# EAGLE design MotionSense (EAGLE 9.6.2)
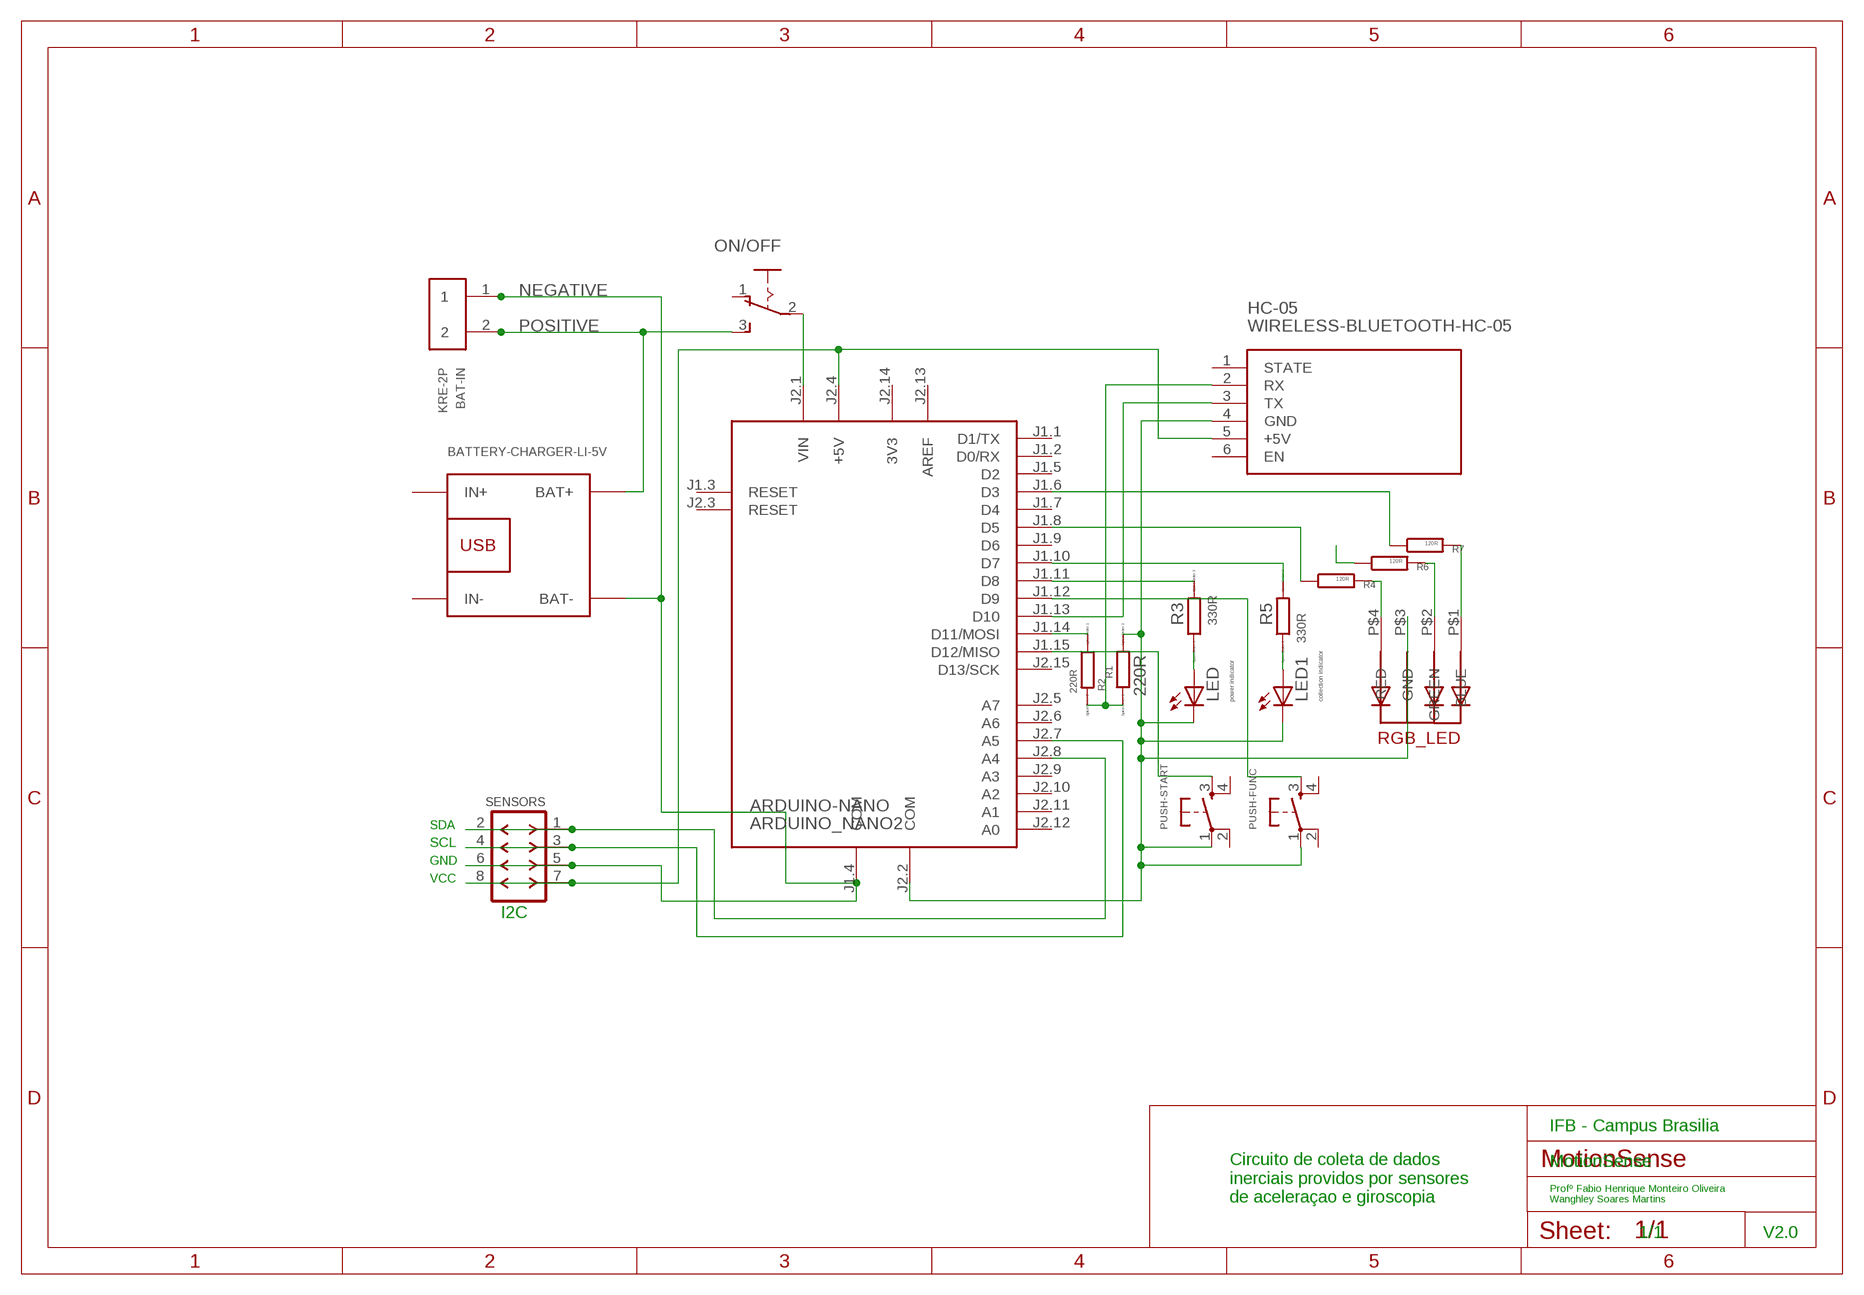
[diagram p0: schematic, sheet 1]

## Parts
ARDUINO-NANO  ARDUINO_NANO2  [ARDUINO_NANO2]
BAT-IN  KRE-2P  [KRE-2P]
HC-05  WIRELESS-BLUETOOTH-HC-05  [WIRELESS-BLUETOOTH-HC-05]
LED  power indicator  LED5MM  [LED5MM]
LED1  collection indicator  LED5MM  [LED5MM]
ON/OFF  255SB  [255SB]
PUSH-FUNC  DTS-6  [DTS-6]
PUSH-START  DTS-6  [DTS-6]
R1  220R  R0207/10  [0207/10]
R2  220R  R0207/10  [0207/10]
R3  330R  R0207/10  [0207/10]
R4  120R  R-EU_0204/7  [0204/7]
R5  330R  R0207/10  [0207/10]
R6  120R  R-EU_0204/7  [0204/7]
R7  120R  R-EU_0204/7  [0204/7]
RGB_LED  5MMRGBLED  [LED5MMRGB]
SENSORS  F-2X04-DIL-2MM_M  [DIL-2MM-2X04_M]
U$1  BATTERY-CHARGER-LI-5V  [BATTERY-CHARGER-LI-5V]

## Nets
N$1: LED.A R3.1
N$2: ARDUINO-NANO.J2.4(+5V) HC-05.5(+5V) SENSORS.7 SENSORS.8
N$3: ARDUINO-NANO.J1.14(D11/MOSI) R2.1
N$4: ARDUINO-NANO.J2.2(COM) HC-05.4(GND) LED1.K(C) LED.K(C) PUSH-FUNC.1 PUSH-START.1 R1.2 RGB_LED.P$3(GND)
N$5: ARDUINO-NANO.J1.13(D10) HC-05.3(TX)
N$6: HC-05.2(RX) R1.1 R2.2
N$7: ARDUINO-NANO.J2.7(A5) SENSORS.3 SENSORS.4
N$8: ARDUINO-NANO.J2.8(A4) SENSORS.1 SENSORS.2
N$9: ARDUINO-NANO.J1.10(D7) R5.2
N$10: ARDUINO-NANO.J1.15(D12/MISO) PUSH-START.3
N$11: ARDUINO-NANO.J2.1(VIN) ON/OFF.2(P)
N$12: ARDUINO-NANO.J1.12(D9) PUSH-FUNC.3
N$13: ARDUINO-NANO.J1.11(D8) R3.2
N$14: LED1.A R5.1
N$17: R4.2 RGB_LED.P$4(RED)
N$18: R6.2 RGB_LED.P$2(GREEN)
N$19: R7.2 RGB_LED.P$1(BLUE)
N$20: ARDUINO-NANO.J1.8(D5) R4.1
N$21: R6.1
N$22: ARDUINO-NANO.J1.6(D3) R7.1
NEGATIVE: ARDUINO-NANO.J1.4(COM) BAT-IN.1 SENSORS.5 SENSORS.6 U$1.BAT-
POSITIVE: BAT-IN.2 ON/OFF.3(S) U$1.BAT+
Unconnected: ARDUINO-NANO.J1.1(D1/TX) ARDUINO-NANO.J1.2(D0/RX) ARDUINO-NANO.J1.3(RESET) ARDUINO-NANO.J1.5(D2) ARDUINO-NANO.J1.7(D4) ARDUINO-NANO.J1.9(D6) ARDUINO-NANO.J2.3(RESET) ARDUINO-NANO.J2.5(A7) ARDUINO-NANO.J2.6(A6) ARDUINO-NANO.J2.9(A3) ARDUINO-NANO.J2.10(A2) ARDUINO-NANO.J2.11(A1) ARDUINO-NANO.J2.12(A0) ARDUINO-NANO.J2.15(D13/SCK) HC-05.1(STATE) HC-05.6(EN) ON/OFF.1(O) PUSH-FUNC.2 PUSH-FUNC.4 PUSH-START.2 PUSH-START.4 U$1.IN+ U$1.IN-

## Notes on the sheet
- SDA
- SCL
- GND
- VCC
- I2C
- IFB - Campus Brasilia
- MotionSense
- Circuito de coleta de dados 
  inerciais providos por sensores 
  de aceleraçao e giroscopia
- Profº Fabio Henrique Monteiro Oliveira
  Wanghley Soares Martins
- 1/1 | V2.0

## Power pins joined to a net without a drawn wire
3V3: ARDUINO-NANO.J2.14(3V3)
AREF: ARDUINO-NANO.J2.13(AREF)

## Library data of the parts
ARDUINO-NANO = arduino_2012:ARDUINO_NANO2: Arduino Nano2 Auto generated by modulcreator.ulp \;; ANZAHL: 2; MODUL: TRUE; STECKX0: -76200; STECKX1: 76200; STECKY0: 177800; STECKY1: 177800
BAT-IN = kre:KRE-2P: KRE Conector 2P
HC-05 = diy-modules:WIRELESS-BLUETOOTH-HC-05: Bluetooth Transceiver Module based on HC-05 board Tutorial is available here: https://arduino-info.wikispaces.com/BlueTooth-HC05-HC06-Modules-How-To Click here to find device on ebay.com <http://www.ebay.com/sch/hc-05+module+rs232>
LED LED1 = led:LED: LED OSRAM: - CHIPLED LG R971, LG N971, LY N971, LG Q971, LY Q971, LO R971, LY R971 LH N974, LH R974 LS Q976, LO Q976, LY Q976 LO Q996 - Hyper CHIPLED LW Q18S LB Q993, LB Q99A, LB R99A - SideLED LS A670, LO A670, LY A670, LG A670, LP A670 LB A673, LV A673, LT A673, LW A673 LH A674 LY A675 LS A676, LA A676, LO A676, LY A676, LW A676 LS A679, LY A679, LG A679 - Hyper Micro SIDELED® LS Y876, LA Y876, LO Y876, LY Y876 LT Y87S - SmartLED LW L88C, LW L88S LB L89C, LB L89S, LG L890 LS L89K, LO L89K, LY L89K LS L896, LA L896, LO L896, LY L896 - TOPLED LS T670, LO T670, LY T670, LG T670, LP T670 LSG T670, LSP T670, LSY T670, LOP T670, LYG T670 LG T671, LOG T671, LSG T671 LB T673, LV T673, LT T673, LW T673 LH T674 LS T676, LA T676, LO T676, LY T676, LB T676, LH T676, LSB T676, LW T676 LB T67C, LV T67C, LT T67C, LS T67K, LO T67K, LY T67K, LW E67C LS E67B, LA E67B, LO E67B, LY E67B, LB E67C, LV E67C, LT E67C LW T67C LS T679, LY T679, LG T679 LS T770, LO T770, LY T770, LG T770, LP T770 LB T773, LV T773, LT T773, LW T773 LH T774 LS E675, LA E675, LY E675, LS T675 LS T776, LA T776, LO T776, LY T776, LB T776 LHGB T686 LT T68C, LB T68C - Hyper Mini TOPLED® LB M676 - Mini TOPLED Santana® LG M470 LS M47K, LO M47K, LY M47K Source: http://www.osram.convergy.de LUXEON: - LUMILED® LXK2-PW12-R00, LXK2-PW12-S00, LXK2-PW14-U00, LXK2-PW14-V00 LXK2-PM12-R00, LXK2-PM12-S00, LXK2-PM14-U00 LXK2-PE12-Q00, LXK2-PE12-R00, LXK2-PE12-S00, LXK2-PE14-T00, LXK2-PE14-U00 LXK2-PB12-K00, LXK2-PB12-L00, LXK2-PB12-M00, LXK2-PB14-N00, LXK2-PB14-P00, LXK2-PB14-Q00 LXK2-PR12-L00, LXK2-PR12-M00, LXK2-PR14-Q00, LXK2-PR14-R00 LXK2-PD12-Q00, LXK2-PD12-R00, LXK2-PD12-S00 LXK2-PH12-R00, LXK2-PH12-S00 LXK2-PL12-P00, LXK2-PL12-Q00, LXK2-PL12-R00 Source: www.luxeon.com KINGBRIGHT: KA-3528ASYC Source: www.kingbright.com
ON/OFF = switch:255SB: SLIDING SWITCH Distributor Buerklin, 11G810
PUSH-FUNC PUSH-START = switch-tact:DTS-6
R1-R3 R5 = eagle-ltspice:R: RESISTOR, European symbol; SPICEMODEL: NONE; SPICEPREFIX: R
R4 R6 R7 = rcl:R-EU_: RESISTOR, European symbol; SPICEPREFIX: R
RGB_LED = led_rgb:5MMRGBLED
SENSORS = con-headers-jp:F-2X04-: FEMALE HEADER
U$1 = diy-modules:BATTERY-CHARGER-LI-5V: Lithium Battery 5V Charger More details available here: http://www.buildcircuit.com/how-to-use-micro-usb-5v-1a-lithium-battery-charging-board-charger-module/ Click here to find device on ebay.com <http://www.ebay.com/sch/tp4056+charger+usb>

## Board
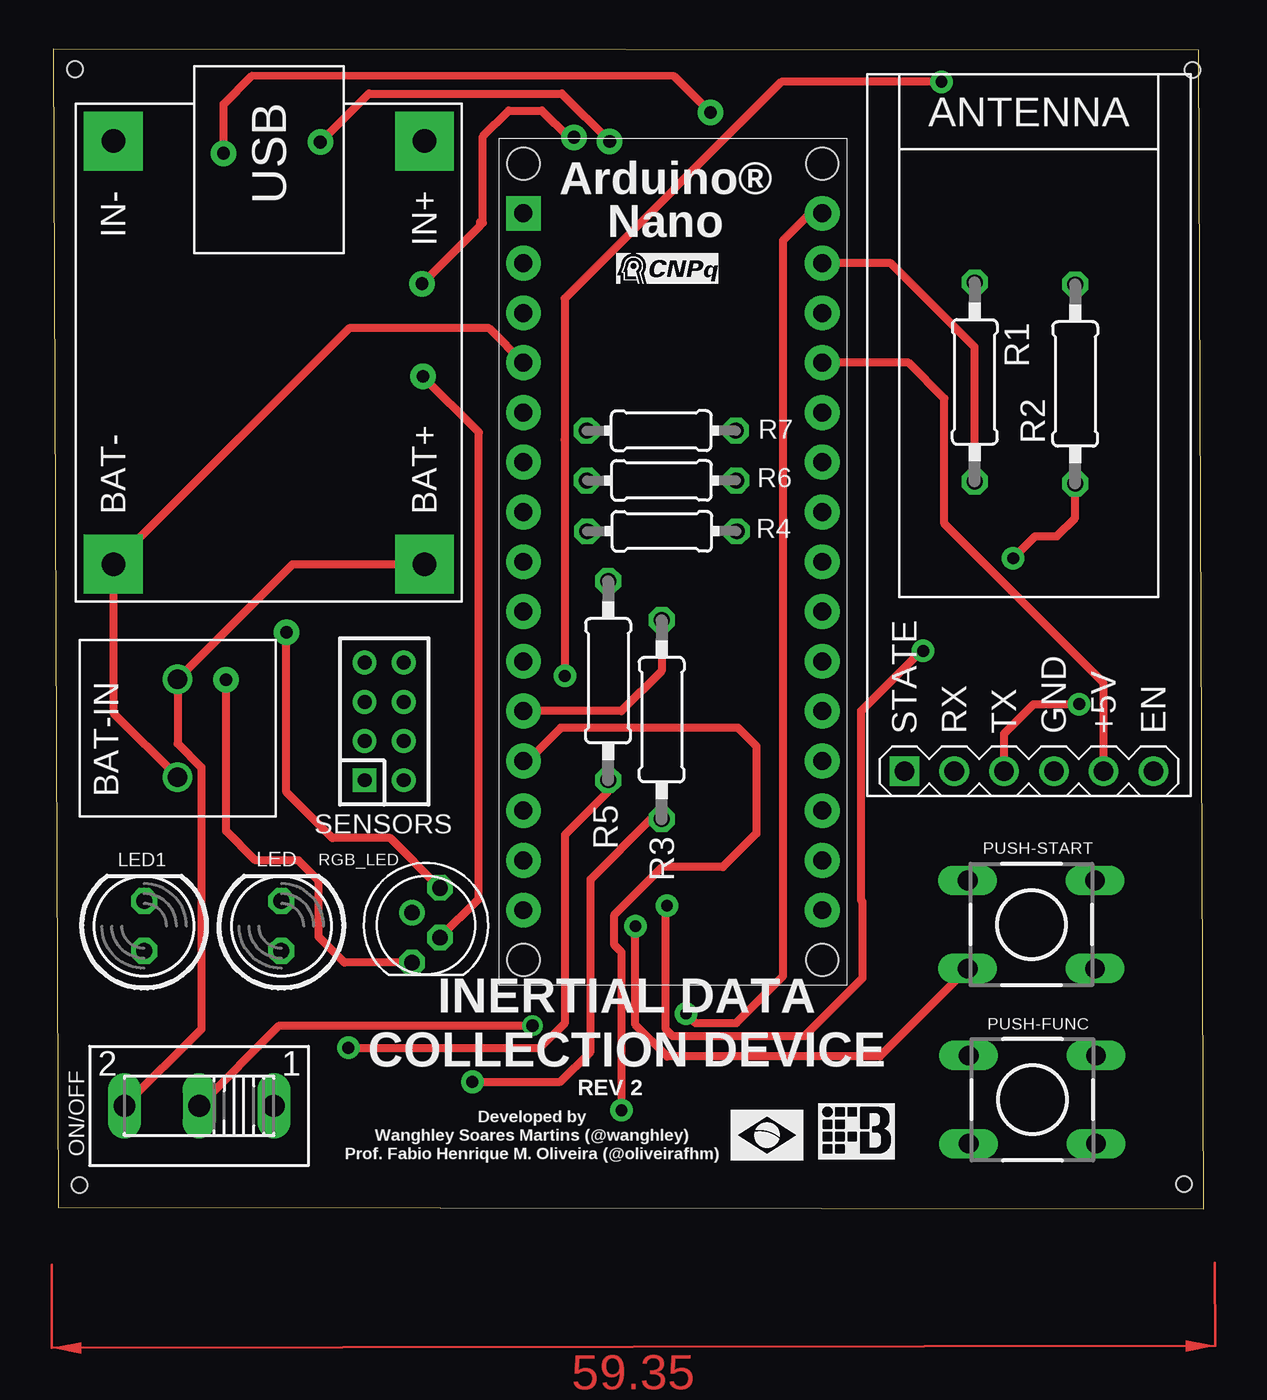
[diagram p1: board, top side]
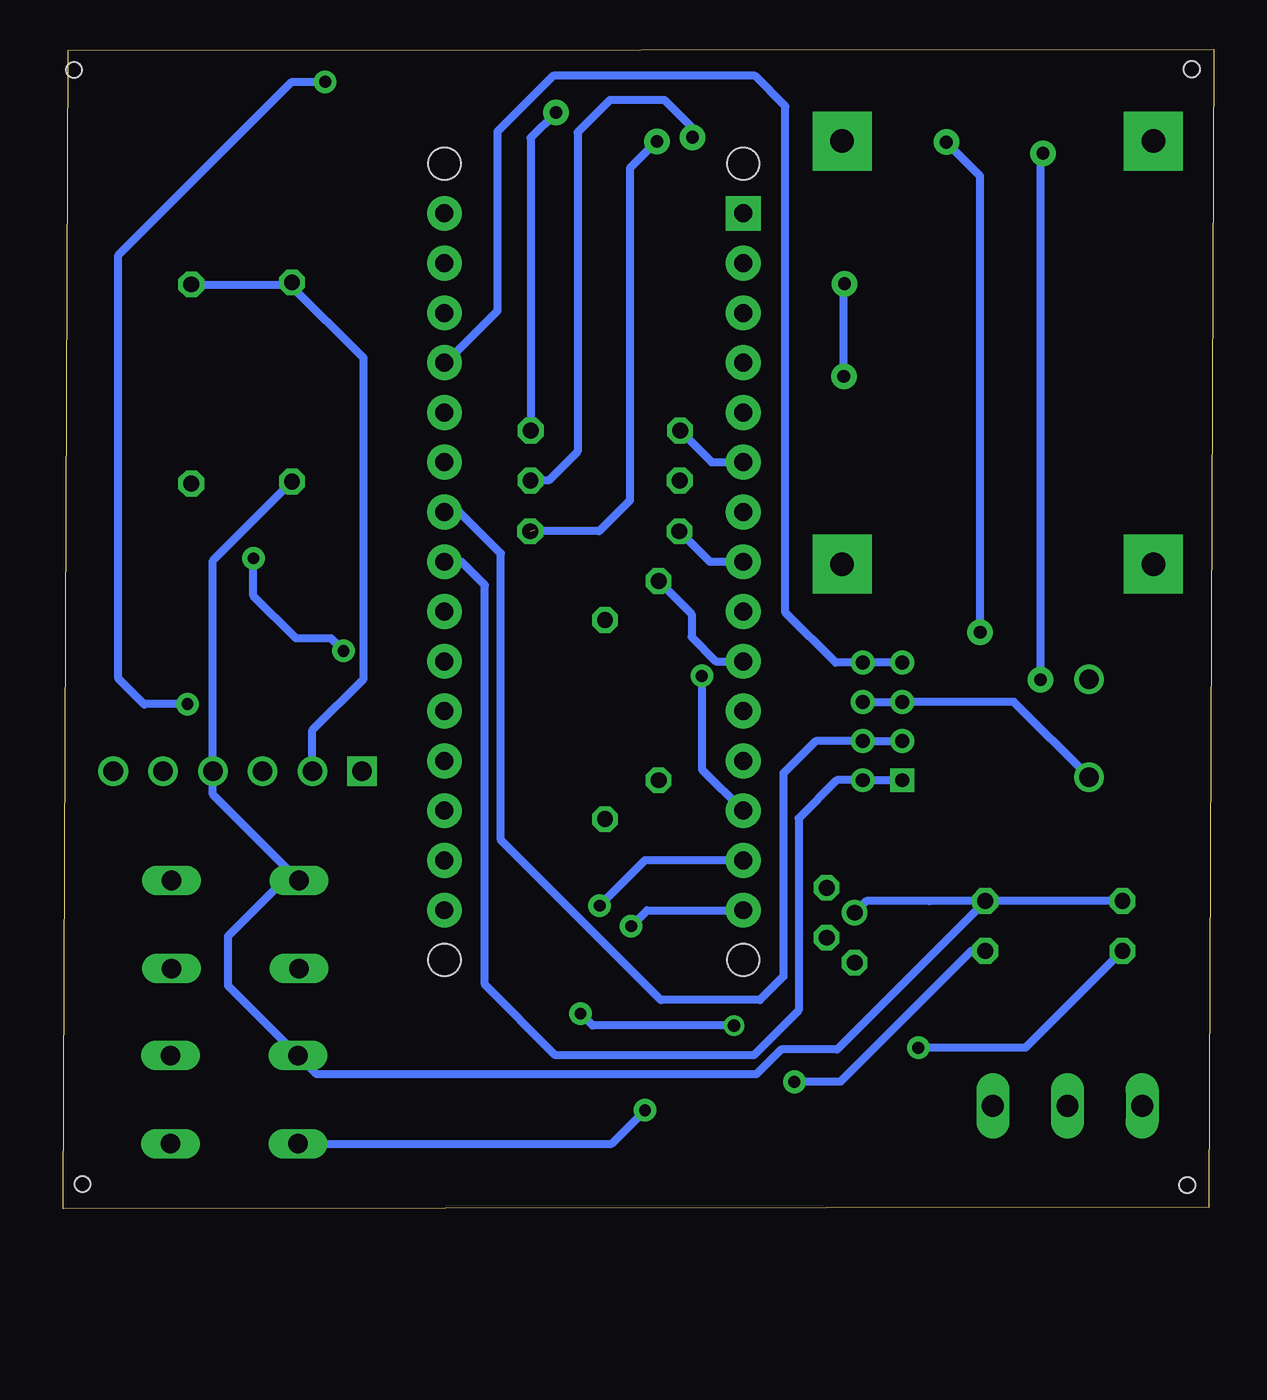
[diagram p2: board, bottom side, seen from below]

Size 58.69 x 59.18 mm. Coordinates in mm from the lower left corner, seen from the top.
Outline: 0.25,0.08 58.69,0 58.44,59.11 0,59.18 0.25,0.08
Copper layers (1*16): Top 0.035mm / dielectric 1.5mm / Bottom 0.035mm
Design rules "default *": minimum track width 6mil, minimum drill 0.35mm, track to track 10mil, track to pad 10mil, pad to pad 10mil, via to via 10mil, smd to smd 10mil, copper to edge 40mil, drill to drill 6mil, minimum pad ring 10mil, minimum via ring 8mil, stop-mask expansion 4mil, vias tented up to drill 0mil, thermal gap 10mil
Holes 0.8 mm at 57.7,1.26 58.13,58.12 1.11,58.15 1.35,1.21

### Footprints (pad centres in the part's own frame; a part is rotated, then mirrored left to right if it is on the bottom)
ARDUINO_NANO2 = drill 0.914 pad 1.778 square: J1.1 -7.62,17.78 | drill 0.914 pad 1.778: J1.2 -7.62,15.24; J1.3 -7.62,12.7; J1.4 -7.62,10.16; J1.5 -7.62,7.62; J1.6 -7.62,5.08; J1.7 -7.62,2.54; J1.8 -7.62,0; J1.9 -7.62,-2.54; J1.10 -7.62,-5.08; J1.11 -7.62,-7.62; J1.12 -7.62,-10.16; J1.13 -7.62,-12.7; J1.14 -7.62,-15.24; J1.15 -7.62,-17.78; J2.1 7.62,17.78; J2.2 7.62,15.24; J2.3 7.62,12.7; J2.4 7.62,10.16; J2.5 7.62,7.62; J2.6 7.62,5.08; J2.7 7.62,2.54; J2.8 7.62,0; J2.9 7.62,-2.54; J2.10 7.62,-5.08; J2.11 7.62,-7.62; J2.12 7.62,-10.16; J2.13 7.62,-12.7; J2.14 7.62,-15.24; J2.15 7.62,-17.78 | hole 1.651: -7.62,-20.32; 7.62,-20.32; 7.62,20.32; -7.62,20.32
KRE-2P = drill 1: 1 -2.54,0; 2 2.46,0
WIRELESS-BLUETOOTH-HC-05 = drill 1 square: 1 -6.35,-17.145 | drill 1: 2 -3.81,-17.145; 3 -1.27,-17.145; 4 1.27,-17.145; 5 3.81,-17.145; 6 6.35,-17.145
LED5MM = drill 0.813 octagon: A -1.27,0; K 1.27,0
255SB = drill 1.118 long: 1 -3.81,0; 2 0,0; 3 3.81,0
DTS-6 = drill 1 long: 1 -3.25,2.25; 2 3.25,2.25; 3 -3.25,-2.25; 4 3.25,-2.25
0207/10 = drill 0.813 octagon: 1 -5.08,0; 2 5.08,0
0204/7 = drill 0.813 octagon: 1 -3.81,0; 2 3.81,0
LED5MMRGB = drill 0.8 pad 0.813 octagon: P$1 -1.905,0.714; P$2 -0.635,-0.714; P$4 1.905,-0.714 | drill 0.8 pad 0.813: P$3 0.635,0.714
DIL-2MM-2X04_M = drill 0.711 square: 1 -3,1 | drill 0.711: 2 -3,-1; 3 -1,1; 4 -1,-1; 5 1,1; 6 1,-1; 7 3,1; 8 3,-1
BATTERY-CHARGER-LI-5V = drill 1.2 pad 3 square: BAT+ 10.795,8.255; BAT- 10.795,-7.62; IN+ -10.795,8.255; IN- -10.795,-7.62

### Placement (x,y rotation side)
ARDUINO-NANO  31.62,33.01 0 top
BAT-IN  6.35,24.56 90 top
HC-05  49.78,39.47 0 top
LED  11.65,14.43 90 top
LED1  4.65,14.43 90 top
ON/OFF  7.45,5.25 180 top
PUSH-FUNC  49.96,5.56 0 top
PUSH-START  49.91,14.5 0 top
R1  47.02,42.19 270 top
R2  52.15,42.09 90 top
R3  31.05,24.96 90 top
R4  31.06,34.57 0 top
R5  28.32,26.94 90 top
R6  31.04,37.17 0 top
R7  31.03,39.71 0 top
RGB_LED  19.02,14.47 90 top
SENSORS  16.89,24.87 90 top
U$1  10.69,43.69 270 top

### Tracks (layer width: path | path; a pad name or v marks a point on that pad's centre or on a via)
N$1  (via drill 0.6 pad 1.15)
  Top 0.406: v21.39,6.47 25.88,6.47 27.42,8.01 27.42,16.8 30.49,19.88 R3.1
  Bottom 0.406: LED.A 12.36,13.16 19.04,6.47 v21.39,6.47
N$2
  Top 0.406: HC-05.5 53.59,26.82 45.47,34.95 45.47,41.35 43.64,43.17 ARDUINO-NANO.J2.4
  Bottom 0.406: 21.84,56.26 21.84,30.42 19.29,27.87 SENSORS.8 SENSORS.7 | 21.86,55.24 21.86,56.26 21.84,56.26 | 21.84,56.26 23.39,57.81 33.7,57.81 36.54,54.97 36.54,45.81 39.18,43.17 ARDUINO-NANO.J2.4
N$3  (via drill 0.6 pad 1.15)
  Top 0.406: 52.15,36.84 R2.1 52.15,35.25 51.21,34.32 50.1,34.32 v48.98,33.19 | v31.32,15.46 31.26,15.41 31.26,9.14 31.6,8.8 38.33,8.8 41.29,11.76 41.29,15.67 41.22,15.73 41.22,25.4 44.29,28.46 v44.39,28.46
  Bottom 0.406: 44.45,28.56 44.45,28.52 v44.39,28.46 45.02,29.1 46.81,29.1 48.98,31.27 v48.98,33.19 | ARDUINO-NANO.J1.14 29.01,17.77 v31.32,15.46
N$4  (via drill 0.35 pad 1.2)
  Top 0.406: R1.2 47.02,43.98 42.74,48.25 ARDUINO-NANO.J2.2
  Bottom 0.406: LED1.K LED.K | LED.K 14.49,15.7 | R1.2 51.05,33.07 HC-05.4 51.05,21.15 PUSH-START.1 47.43,16.75 50.28,13.91 50.28,11.38 PUSH-FUNC.1 45.76,6.86 23.33,6.86 22.07,8.12 19.2,8.12 11.65,15.67 LED.K | LED.K 17.72,15.7 RGB_LED.P$3
  other vias: 46.71,7.81
N$5  (via drill 0.6 pad 1.15)
  Top 0.406: HC-05.3 48.51,24.24 50.02,25.75 v52.35,25.75 | 26.05,27.25 v26.11,27.19 26.11,39.24 26.1,39.24 26.1,46.45 37.15,57.51 v45.32,57.51
  Bottom 0.406: v26.11,27.19 26.11,22.42 ARDUINO-NANO.J1.13 | v52.35,25.75 54.52,25.75 54.55,25.72 55.87,27.05 55.87,48.66 47.03,57.51 v45.32,57.51
N$6
  Bottom 0.381: 47.09,47.19 R1.1
  Bottom 0.406: R2.2 47.12,47.17 | 47.12,47.17 R1.1 | HC-05.2 45.97,24.42 43.36,27.04 43.36,43.41 47.12,47.17
N$7
  Bottom 0.406: SENSORS.3 SENSORS.4 20.3,23.87 21.95,22.22 21.95,11.85 23.15,10.65 28.2,10.65 36.36,18.81 36.36,33.44 38.48,35.55 ARDUINO-NANO.J2.7
N$8
  Bottom 0.406: SENSORS.1 SENSORS.2 19.22,21.87 21.17,19.92 21.17,10.12 23.45,7.83 33.57,7.83 37.18,11.44 37.18,31.82 38.37,33.01 ARDUINO-NANO.J2.8
N$9
  Bottom 0.406: R5.2 26.63,30.34 26.63,29.18 25.39,27.93 ARDUINO-NANO.J1.10
N$10  (via drill 0.6 pad 1.15)
  Top 0.406: PUSH-START.3 42.18,7.77 31.32,7.77 29.71,9.38 v29.71,14.42
  Bottom 0.406: v29.71,14.42 28.9,15.23 ARDUINO-NANO.J1.15
N$11  (via drill 0.6 pad 1.15, 0.65)
  Top 0.406: v32.29,9.95 32.77,9.48 34.85,9.48 37.25,11.87 37.25,49.42 38.62,50.79 ARDUINO-NANO.J2.1 | 7.45,5.93 ON/OFF.2 11.55,9.34 v24.46,9.34
  Bottom 0.406: 32.29,9.61 v32.29,9.95 31.68,9.34 v24.46,9.34
N$12  (via drill 0.6 pad 1.15)
  Top 0.406: ARDUINO-NANO.J1.12 24.21,22.85 25.89,24.53 34.95,24.53 35.87,23.61 35.87,19.14 34.17,17.43 31.07,17.43 28.63,14.99 28.63,13.45 29,13.08 v29,5.02
  Bottom 0.406: PUSH-FUNC.3 30.71,3.31 v29,5.02
N$13
  Top 0.406: R3.2 31.05,27.45 28.99,25.39 ARDUINO-NANO.J1.11
N$14  (via drill 0.6 pad 1.15)
  Top 0.406: v15.06,8.21 24.84,8.21 26.12,9.49 26.12,19.1 28.32,21.29 R5.1
  Bottom 0.406: LED1.A 9.6,8.21 v15.06,8.21
N$16  (via drill 0.35 pad 1.3)
  other vias: 6.36,27
N$17  (via drill 0.65 pad 1.3)  (1 unrouted)
  Top 0.406: RGB_LED.P$4 17.2,18.91 14.25,18.91 11.91,21.25 v11.91,29.42 | v13.63,54.43 16.11,56.91 25.96,56.91 v28.4,54.47
  Bottom 0.406: v11.91,29.42 11.91,52.7 v13.63,54.43 | 34.63,34.65 | v28.4,54.47 29.77,53.09 29.77,36.14 31.35,34.57 R4.2
N$18  (via drill 0.65 pad 1.3)
  Top 0.406: RGB_LED.P$2 21.72,15.81 21.72,39.62 v18.87,42.47 | v18.83,47.2 21.77,50.15 | 21.77,50.36 21.77,50.15 | 21.77,50.15 21.93,50.31 21.93,54.73 23.24,56.04 24.94,56.04 26.3,54.68 v26.58,54.68
  Bottom 0.406: v18.87,42.47 18.87,46.83 18.95,46.91 18.95,47.08 v18.83,47.2 | v26.58,54.68 26.58,55.14 28.01,56.57 30.8,56.57 32.45,54.92 32.45,38.64 33.92,37.16 R6.2
N$19  (via drill 0.65 pad 1.3)
  Top 0.406: RGB_LED.P$1 14.86,12.56 13.55,13.87 13.55,16.73 12.51,17.77 10.32,17.77 8.82,19.27 v8.82,26.99 | v8.7,53.86 8.7,56.37 10.14,57.81 31.7,57.78 v33.54,55.94
  Bottom 0.406: v8.82,26.99 8.82,53.73 v8.7,53.86 | v33.54,55.94 34.84,54.65 R7.2
N$20
  Bottom 0.406: R4.1 25.69,33.01 ARDUINO-NANO.J1.8
N$22
  Bottom 0.406: R7.1 25.61,38.09 ARDUINO-NANO.J1.6
NEGATIVE
  Top 0.406: ARDUINO-NANO.J1.4 22.24,44.93 15.11,44.93 U$1.BAT- 3.07,25.3 BAT-IN.1
  Bottom 0.406: BAT-IN.1 10.19,25.87 SENSORS.5 SENSORS.6
POSITIVE
  Top 0.406: U$1.BAT+ 12.22,32.89 BAT-IN.2 6.35,23.73 7.56,22.52 7.56,9.16 ON/OFF.3
(copper drawn outside any net)
  shapes: Top area x2

### Text on the board
tPlace: Arduino® / Nano | /home/wanghley/Desktop/cnpq3.bmp | INERTIAL DATA / COLLECTION DEVICE | REV 2 | Developed by / Wanghley Soares Martins (@wanghley) / Prof. Fabio Henrique M. Oliveira (@oliveirafhm) | /home/wanghley/Desktop/brazil-flag-min.bmp | /home/wanghley/Desktop/ifb.bmp